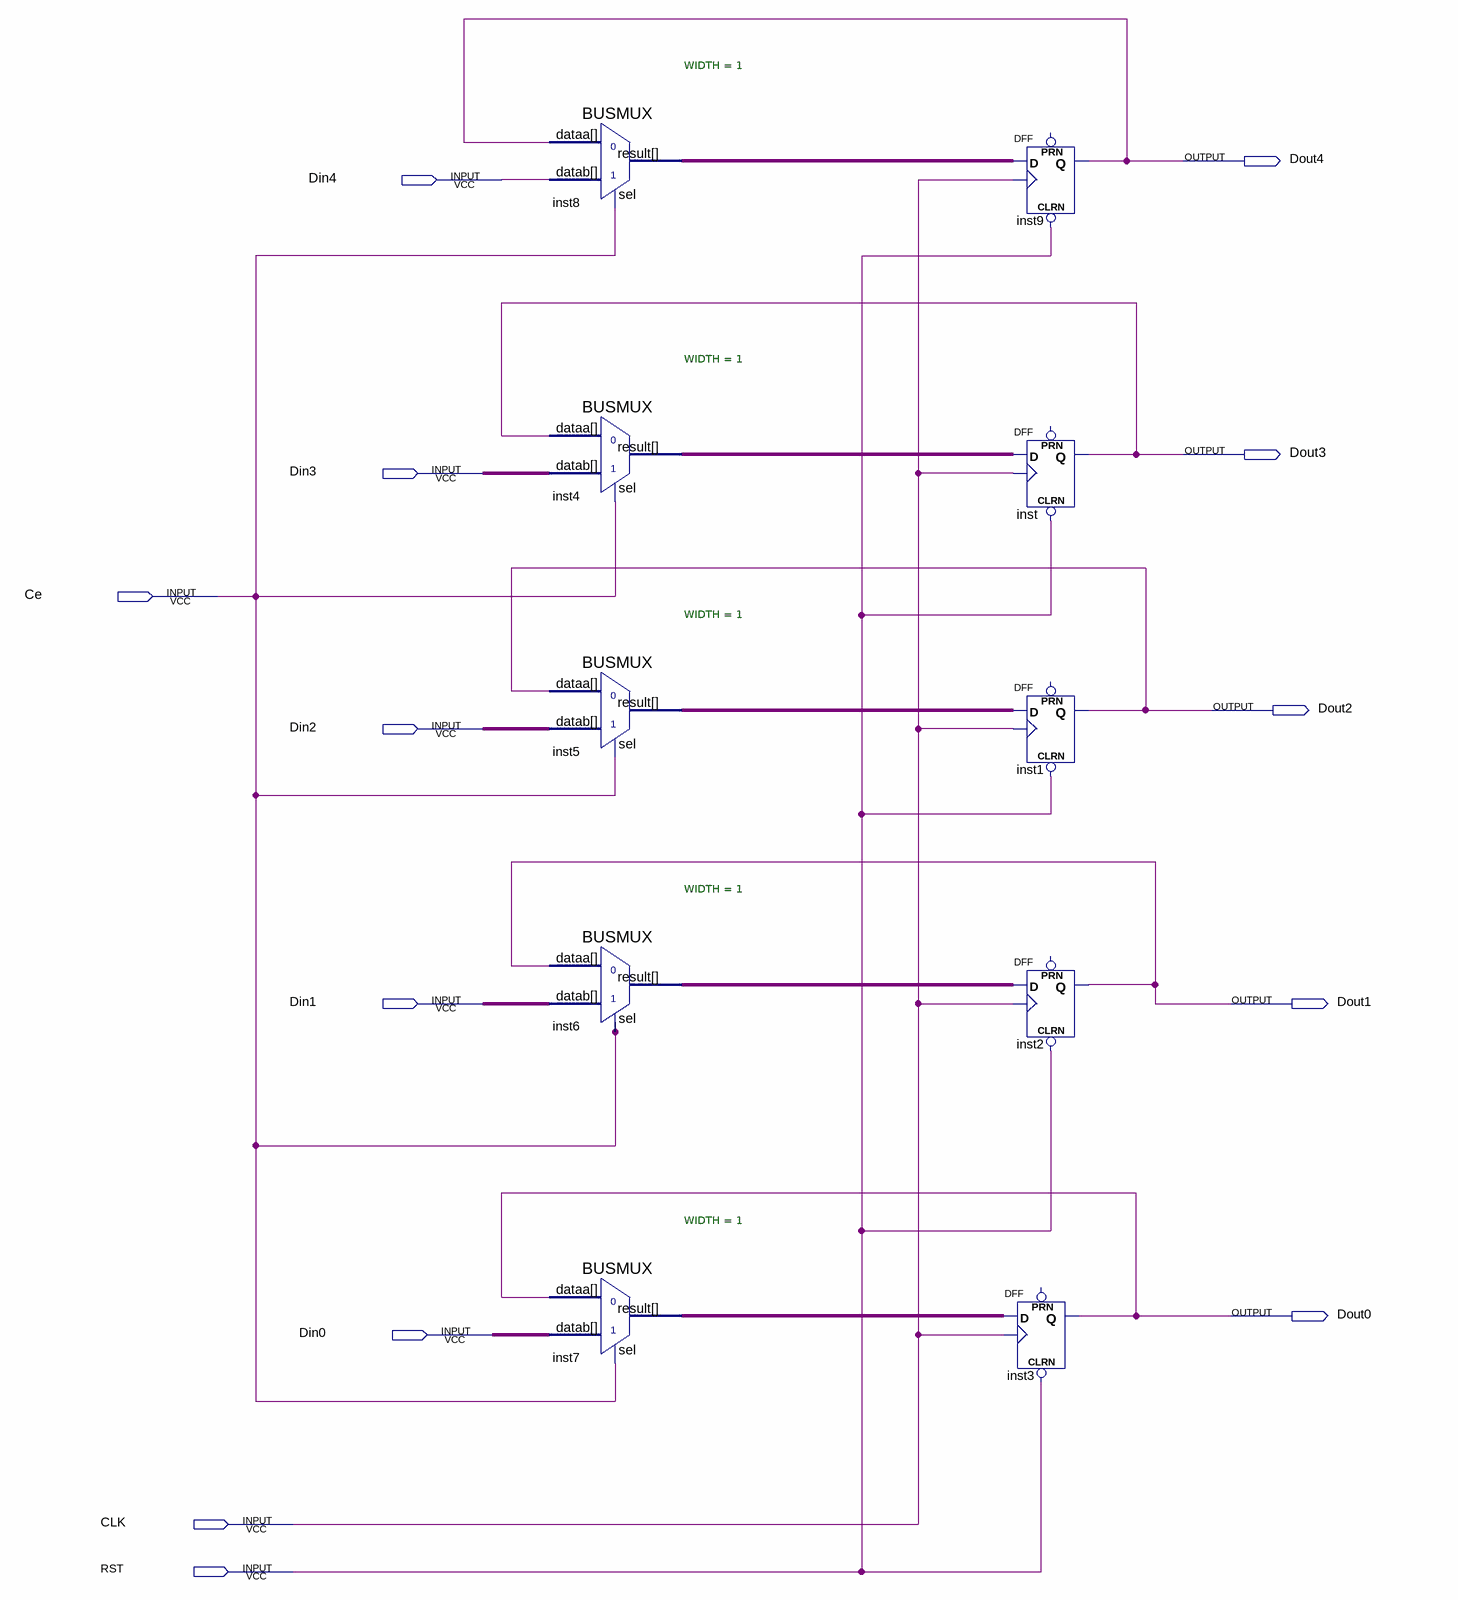
[diagram p0: schematic sheet]
// Quartus schematic five_bits_register.bdf as structural Verilog: 10 symbols, 13 pins
module five_bits_register (
  input  Din4,
  input  Din3,
  input  Ce,
  input  Din2,
  input  Din1,
  input  Din0,
  input  CLK,
  input  RST,
  output Dout4,
  output Dout3,
  output Dout2,
  output Dout1,
  output Dout0
);

  wire inst4_result, inst5_result, inst6_result, inst7_result, inst8_result;

  BUSMUX #(.WIDTH(1)) inst8 (.datab(Din4), .sel(Ce), .dataa(Dout4), .result(inst8_result));
  BUSMUX #(.WIDTH(1)) inst4 (.datab(Din3), .sel(Ce), .dataa(Dout3), .result(inst4_result));
  BUSMUX #(.WIDTH(1)) inst5 (.datab(Din2), .sel(Ce), .dataa(Dout2), .result(inst5_result));
  BUSMUX #(.WIDTH(1)) inst6 (.datab(Din1), .sel(Ce), .dataa(Dout1), .result(inst6_result));
  BUSMUX #(.WIDTH(1)) inst7 (.datab(Din0), .sel(Ce), .dataa(Dout0), .result(inst7_result));
  DFF inst9 (.CLRN(RST), .CLK(CLK), .D(inst8_result), .Q(Dout4));  // open: PRN
  DFF inst (.CLRN(RST), .CLK(CLK), .D(inst4_result), .Q(Dout3));  // open: PRN
  DFF inst1 (.CLRN(RST), .CLK(CLK), .D(inst5_result), .Q(Dout2));  // open: PRN
  DFF inst2 (.CLRN(RST), .CLK(CLK), .D(inst6_result), .Q(Dout1));  // open: PRN
  DFF inst3 (.CLRN(RST), .CLK(CLK), .D(inst7_result), .Q(Dout0));  // open: PRN
endmodule
